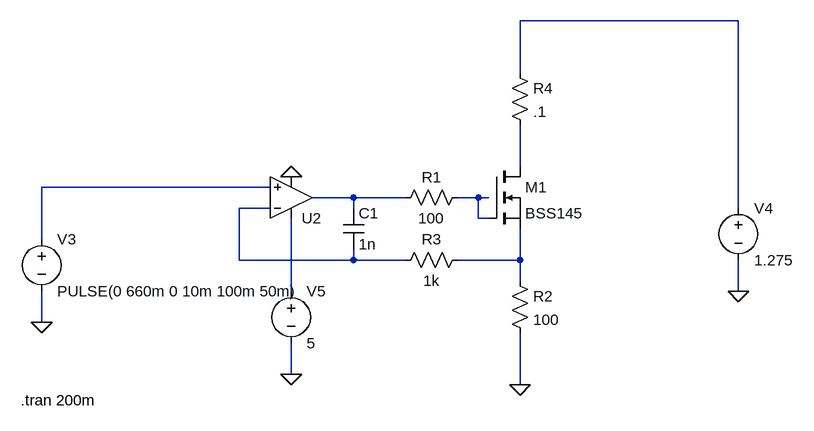
[diagram p0: schematic variable_current_source.asc]
variable_current_source.asc, the LTspice schematic file:
Version 4
SHEET 1 880 680
WIRE 672 -272 336 -272
WIRE 336 -192 336 -272
WIRE 336 -48 336 -112
WIRE -48 -16 -400 -16
WIRE 80 0 16 0
WIRE 160 0 80 0
WIRE 272 0 240 0
WIRE 288 0 272 0
WIRE -48 16 -96 16
WIRE 80 16 80 0
WIRE 672 16 672 -272
WIRE 272 32 272 0
WIRE 288 32 272 32
WIRE -400 64 -400 -16
WIRE -96 96 -96 16
WIRE 80 96 80 80
WIRE 80 96 -96 96
WIRE 160 96 80 96
WIRE 336 96 336 48
WIRE 336 96 240 96
WIRE 336 128 336 96
WIRE -16 144 -16 32
WIRE 672 144 672 96
WIRE -400 192 -400 144
WIRE -16 272 -16 224
WIRE 336 288 336 208
FLAG -16 -32 0
FLAG -400 192 0
FLAG -16 272 0
FLAG 336 288 0
FLAG 672 144 0
SYMBOL Opamps\\UniversalOpamp2 -16 0 M180
SYMATTR InstName U2
SYMBOL voltage -400 48 R0
WINDOW 123 0 0 Left 2
WINDOW 39 0 0 Left 2
SYMATTR InstName V3
SYMATTR Value PULSE(0 660m 0 10m 100m 50m)
SYMBOL res 256 -16 R90
WINDOW 0 0 56 VBottom 2
WINDOW 3 32 56 VTop 2
SYMATTR InstName R1
SYMATTR Value 100
SYMBOL res 320 112 R0
SYMATTR InstName R2
SYMATTR Value 100
SYMBOL res 256 80 R90
WINDOW 0 0 56 VBottom 2
WINDOW 3 32 56 VTop 2
SYMATTR InstName R3
SYMATTR Value 1k
SYMBOL cap 64 16 R0
SYMATTR InstName C1
SYMATTR Value 1n
SYMBOL res 320 -208 R0
SYMATTR InstName R4
SYMATTR Value .1
SYMBOL voltage 672 0 R0
WINDOW 123 0 0 Left 2
WINDOW 39 0 0 Left 2
SYMATTR InstName V4
SYMATTR Value 1.275
SYMBOL voltage -16 128 R0
WINDOW 123 0 0 Left 2
WINDOW 39 0 0 Left 2
SYMATTR InstName V5
SYMATTR Value 5
SYMBOL nmos 288 -48 R0
SYMATTR InstName M1
SYMATTR Value BSS145
TEXT -432 312 Left 2 !.tran 200m

The netlist it stands for:
* variable_current_source.asc
XU2 N003 N006 N008 0 N004 level.2 Avol=1Meg GBW=10Meg Slew=10Meg ilimit=25m rail=0 Vos=0 phimargin=45 en=0 enk=0 in=0 ink=0 Rin=500Meg  ; pins IN+ IN- V+ V- OUT
V3 N003 0 PULSE(0 660m 0 10m 100m 50m)
R1 N005 N004 100
R2 N007 0 100
R3 N007 N006 1k
C1 N004 N006 1n
R4 N001 N002 .1
V4 N001 0 1.275
V5 N008 0 5
M1 N002 N005 N007 N007 BSS145
.model NMOS NMOS
.model PMOS PMOS
.lib standard.mos
.tran 200m
.lib UniversalOpamps2.sub
.backanno
.end